# Altium project imu_board.PrjPcb
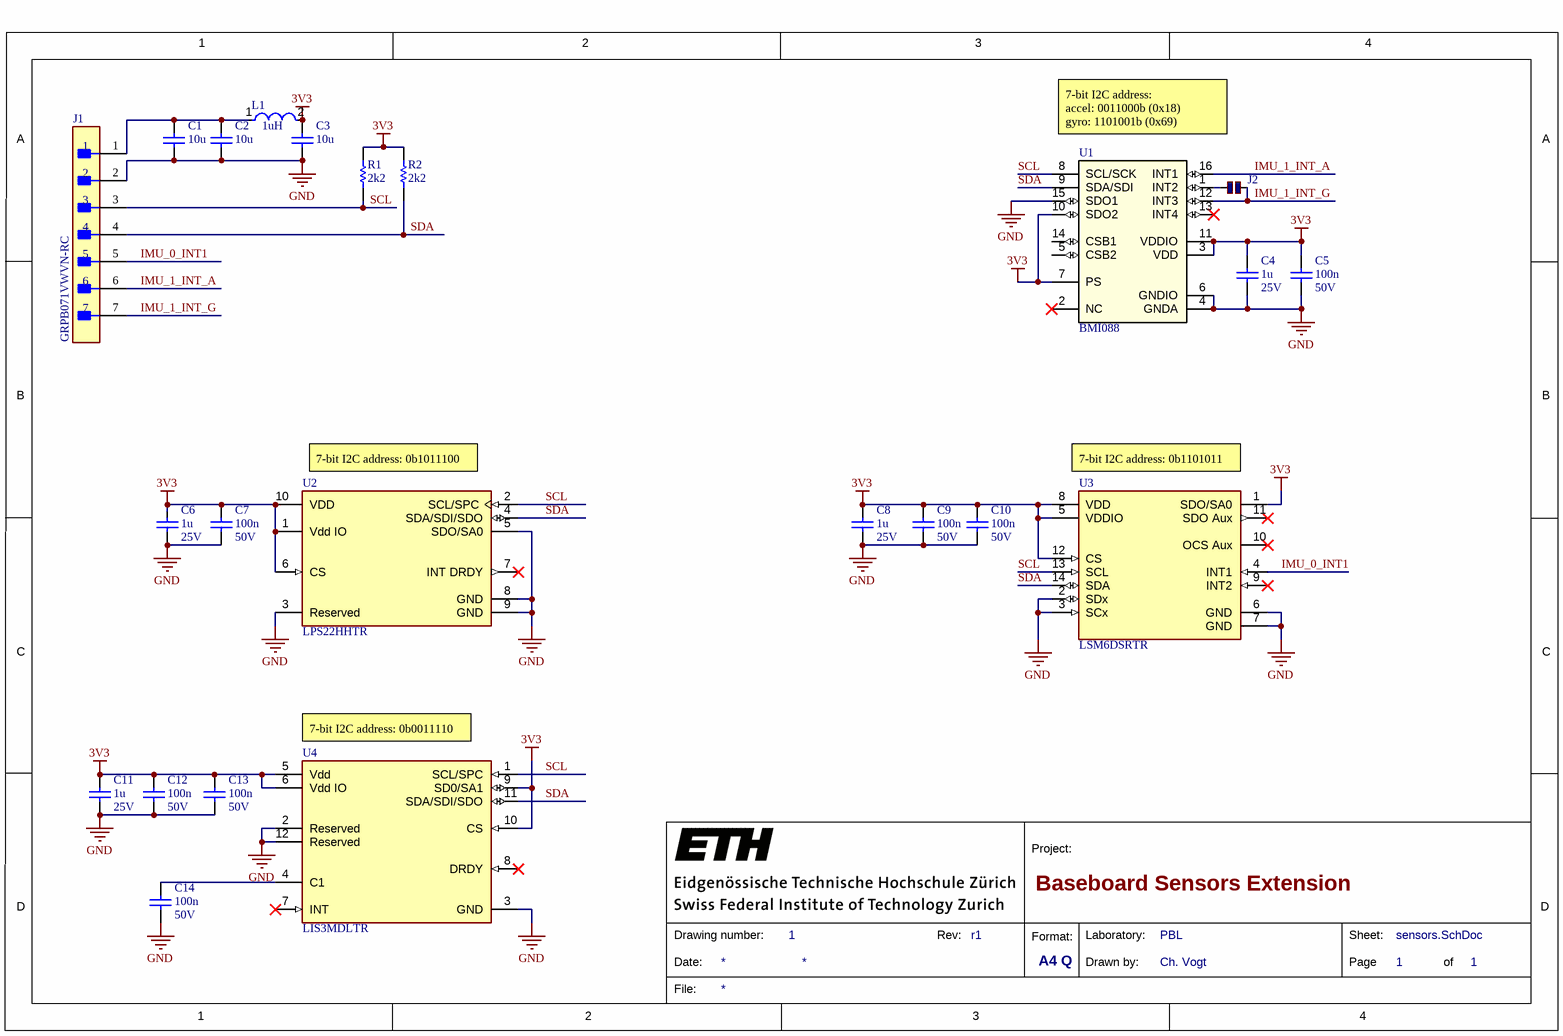
[diagram p0: sensors.SchDoc]
1 sheet, 23 parts. Net scope: global (net labels, ports and power ports of the same name join across sheets).
Board file: imu_board_r1.PcbDoc

## Sheet sensors.SchDoc: Baseboard Sensors Extension
size A4; DrawnBy: Ch. Vogt; Organization: PBL; DocumentNumber: 1; Revision: r1; SheetNumber: 1; SheetTotal: 1

### Parts
C1  10u  [CAPC0402]
C2  10u  [CAPC0402]
C3  10u  [CAPC0402]
C4  1u  Rated DC Voltage (URdc): 25V  [CAPC0402]
C5  100n  Rated DC Voltage (URdc): 50V  [CAPC0402]
C6  1u  Rated DC Voltage (URdc): 25V  [CAPC0402]
C7  100n  Rated DC Voltage (URdc): 50V  [CAPC0402]
C8  1u  Rated DC Voltage (URdc): 25V  [CAPC0402]
C9  100n  Rated DC Voltage (URdc): 50V  [CAPC0402]
C10  100n  Rated DC Voltage (URdc): 50V  [CAPC0402]
C11  1u  Rated DC Voltage (URdc): 25V  [CAPC0402]
C12  100n  Rated DC Voltage (URdc): 50V  [CAPC0402]
C13  100n  Rated DC Voltage (URdc): 50V  [CAPC0402]
C14  100n  Rated DC Voltage (URdc): 50V  [CAPC0402]
J1  GRPB071VWVN-RC  [FP-GRPB071VWVN-RC-MFG]
J2  Solder Jumper  [Small Solder Jumper]  (value not drawn)
L1  Inductance: 1uH  [FP-MLZ1005-MFG]  (hidden comment: MLZ1005M1R0WT000)
R1  2k2  [RES0402]
R2  2k2  [RES0402]
U1  BMI088  [QFN_BMI085_BOS]
U2  LPS22HHTR  [FP-HLGA-10L-DM00386636-MFG]
U3  LSM6DSRTR  [FP-LGA-14L-DM00249496-MFG]
U4  LIS3MDLTR  [FP-VFLGA-12-8365767-MFG]

### Nets
3V3: C3.2 C4.2 C5.2 C6.2 C7.2 C8.2 C9.2 C10.2 C11.2 C12.2 C13.2 L1.2 R1.2 R2.2 U1.3(VDD) U1.7(PS) U1.10(SDO2) U1.11(VDDIO) U2.1(Vdd_IO) U2.6(CS) U2.10(VDD) U3.1(SDO/SA0) U3.5(VDDIO) U3.8(VDD) U3.12(CS) U4.5(Vdd) U4.6(Vdd_IO) U4.9(SD0/SA1) U4.10(CS)
GND: C1.1 C2.1 C3.1 C4.1 C5.1 C6.1 C7.1 C8.1 C9.1 C10.1 C11.1 C12.1 C13.1 C14.1 J1.2 U1.4(GNDA) U1.6(GNDIO) U1.15(SDO1) U2.3(Reserved) U2.5(SDO/SA0) U2.8(GND) U2.9(GND) U3.2(SDx) U3.3(SCx) U3.6(GND) U3.7(GND) U4.2(Reserved) U4.3(GND) U4.12(Reserved)
IMU_0_INT1: J1.5 U3.4(INT1)
IMU_1_INT_A: J1.6 U1.16(INT1)
IMU_1_INT_G: J1.7 J2.1 U1.12(INT3)
SCL: J1.3 R1.1 U1.8(SCL/SCK) U2.2(SCL/SPC) U3.13(SCL) U4.1(SCL/SPC)
SDA: J1.4 R2.1 U1.9(SDA/SDI) U2.4(SDA/SDI/SDO) U3.14(SDA) U4.11(SDA/SDI/SDO)
NetC1_2: C1.2 C2.2 J1.1 L1.1
NetC14_2: C14.2 U4.4(C1)
NetJ2_2: J2.2 U1.1(INT2)

Not connected (* = marked no-connect by the designer): U1 2(NC)* 5(CSB2) 13(INT4)* 14(CSB1); U2 7(INT_DRDY)*; U3 9(INT2)* 10(OCS_Aux)* 11(SDO_Aux)*; U4 7(INT)* 8(DRDY)*

### Notes on the sheet
- 7-bit I2C address:
  accel: 0011000b (0x18)
  gyro: 1101001b (0x69)
- (near U2) 7-bit I2C address: 0b1011100
- (near U3) 7-bit I2C address: 0b1101011
- (near U4) 7-bit I2C address: 0b0011110
- 1
- 2
- 3
- 4
- A
- B
- C
- Project:
- D
- Date:
- Drawing number:
- Rev:
- Format:
- A4 Q
- Drawn by:
- Laboratory:
- Page
- Sheet:
- of
- File:

### Library data of the parts
C1-C3 = cap0402: Ceramic Capacitor, Multilayer, Ceramic, 10V, 20% +Tol, 20% -Tol, X5R, 15% TC, 10uF, Surface Mount, 0402; Manufacturer: Samsung; Manufacturer Part Number: CL05A106MP5NUNC; Multilayer: Yes; Supplier: Digikey; Supplier Part Number: 1276-1450-1-ND; RoHS: Yes; Category: Ceramic Capacitors; Stock: 2505826; Pricing: 1=0.18, 10=0.115, 50=0.0726, 100=0.058, 500=0.04192, 1000=0.03708, 2500=0.03546, 5000=0.03224 (USD); Mounting Technology: Surface Mount; Pins: 2; Dielectric Material: Ceramic; Package Shape: Rectangular; Case/Package: 0402; Terminal Finish: Nickel; Min Operating Temperature: -55°C; Max Operating Temperature: 85°C; Value: 10uF; Capacitor Type: Ceramic; Tolerance  (fill in as +-): 20%; Packaging: Tape and Reel; Tolerance (fill in as +-): 20%; Rated DC Voltage (URdc): 10V; Termination: Wraparound; Temperature Characteristics Code: X5R; JESD-609 Code: e3; Package Style: SMTMeter; Length: 1mm; Width: 0.5mm; Height: 0.7mm; RoHS Compliant: Yes; Reach SVHC Compliant: Yes; ComponentLink1URL: https://datasheet.ciiva.com:443/pdfs/VipMasterIC/IC/SEMS/SEMS-S-A0008384515/SEMS-S-A0008872829-1.pdf?src-supplier=IHS+Markit; ComponentLink1Description: https://datasheet.ciiva.com:443/pdfs/VipMasterIC/IC/SEMS/SEMS-S-A0008384515/SEMS-S-A0008872829-1.pdf?src-supplier=IHS+Markit
C4 C6 C8 C11 = cap0402: Ceramic Capacitor, Multilayer, Ceramic, 25V, 20% +Tol, 20% -Tol, X5R, 15% TC, 1uF, Surface Mount, 0402; Manufacturer: Taiyo Yuden; Manufacturer Part Number: TMK105BJ105MV-F; Multilayer: Yes; Supplier: Rs; Supplier Part Number: 1843748; RoHS: Yes; Category: Ceramic Capacitors; Stock: 2400; Pricing: 200=0.05600, 600=0.05000, 1000=0.03900 (CHF); Mounting Technology: Surface Mount; Pins: 2; Dielectric Material: Ceramic; Case/Package: 0402; Package Shape: Rectangular; Terminal Finish: Nickel; Min Operating Temperature: -55°C; Max Operating Temperature: 85°C; Value: 1uF; Capacitor Type: Ceramic; Tolerance  (fill in as +-): 20%; Packaging: Tape and Reel; Tolerance (fill in as +-): 20%; Temperature Characteristics Code: X5R; Termination: Wraparound; Package Style: SMTMeter; JESD-609 Code: e3; Length: 1mm; Width: 0.5mm; Height: 0.5mm; Reach SVHC Compliant: Yes; RoHS Compliant: Yes; ComponentLink1URL: https://datasheet.ciiva.com:443/pdfs/VipMasterIC/IC/TAIY/TAIY-S-A0009103435/TAIY-S-A0009102669-1.pdf?src-supplier=IHS+Markit; ComponentLink1Description: https://datasheet.ciiva.com:443/pdfs/VipMasterIC/IC/TAIY/TAIY-S-A0009103435/TAIY-S-A0009102669-1.pdf?src-supplier=IHS+Markit; ComponentLink2URL: https://datasheet.ciiva.com/11596/tmk105bj105mv-f-ss-11596466.pdf?src-supplier=Avnet; ComponentLink2Description: https://datasheet.ciiva.com/11596/tmk105bj105mv-f-ss-11596466.pdf?src-supplier=Avnet; ComponentLink3URL: https://datasheet.ciiva.com/30154/128tmk105bj105mv-f-30154639.pdf?src-supplier=Onlinecomponents.com; ComponentLink3Description: https://datasheet.ciiva.com/30154/128tmk105bj105mv-f-30154639.pdf?src-supplier=Onlinecomponents.com; ComponentLink4URL: https://datasheet.ciiva.com/15922/tmk105bj105mv-f-pdf-15922317.pdf?src-supplier=Onlinecomponents.com; ComponentLink4Description: https://datasheet.ciiva.com/15922/tmk105bj105mv-f-pdf-15922317.pdf?src-supplier=Onlinecomponents.com; ComponentLink5URL: https://datasheet.ciiva.com/13404/mlcc-all-e-541559-13404206.pdf?src-supplier=Mouser; ComponentLink5Description: https://datasheet.ciiva.com/13404/mlcc-all-e-541559-13404206.pdf?src-supplier=Mouser
C5 C7 C9 C10 C12-C14 = cap0402: Ceramic Capacitor, Multilayer, Ceramic, 50V, 10% +Tol, 10% -Tol, X5R, 15% TC, 0.1uF, Surface Mount, 0402; Manufacturer: Yageo; Manufacturer Part Number: CC0402KRX5R9BB104; Capacitance: 100nF; Multilayer: Yes; Supplier 1: Farnell; Supplier Part Number 1: 3366442; RoHS: Yes; Category: Ceramic Capacitors; Stock 1: 180000; Pricing 1: 10000=0.00890, 50000=0.00870 (CHF); Mount: Surface Mount; Number of Pins: 2; Dielectric Material: Ceramic; Package Shape: Rectangular; Size Code: 0402; Terminal Finish: Nickel; Min Operating Temperature: -55°C; Max Operating Temperature: 85°C; JESD-609 Code: e3; Capacitor Type: Ceramic; Negative Tolerance: 10%; Temperature Characteristics Code: X5R; Termination: Wraparound; Positive Tolerance: 10%; Package Style: SMTMeter; Packaging: Tape and Reel; Length: 1mm; Width: 0.5mm; Height: 0.5mm; Reach SVHC Compliant: Yes; RoHS Compliant: Yes; ComponentLink1URL: https://datasheet.ciiva.com:443/pdfs/VipMasterIC/IC/YAGO/YAGO-S-A0006851646/YAGO-S-A0006851646-1.pdf?src-supplier=IHS+Markit; ComponentLink1Description: https://datasheet.ciiva.com:443/pdfs/VipMasterIC/IC/YAGO/YAGO-S-A0006851646/YAGO-S-A0006851646-1.pdf?src-supplier=IHS+Markit; ComponentLink2URL: http://www.yageo.com/documents/recent/UPY-GPHC_X5R_4V-to-50V_25.pdf?src-supplier=Digi-Key; ComponentLink2Description: http://www.yageo.com/documents/recent/UPY-GPHC_X5R_4V-to-50V_25.pdf?src-supplier=Digi-Key; ComponentLink3URL: http://www.yageo.com/documents/recent/UPY-GPHC_X5R_4V-to-50V_23.pdf?src-supplier=Digi-Key; ComponentLink3Description: http://www.yageo.com/documents/recent/UPY-GPHC_X5R_4V-to-50V_23.pdf?src-supplier=Digi-Key
J1 = CMP-25680-000036-1: CONN HEADER VERT 7POS 1.27MM; Pitch: 0.05inch; Connector Type: Male Pin; Number of Positions: 7; Contact Mating Length: 0.118inch; Number of Rows: 1; Mount: Through Hole; Packaging: Bulk; Contact Type: Male Pin; Contact Plating: Gold; Termination: Solder; Lead Free: Lead Free; Package Quantity: 1; RoHS Compliant: Yes
J2 = CMP-00005-5: Value: 1; Technology: SMT
L1 = CMP-08253-000219-1: Shielded Multilayer Inductor 1uH ±20% 450mA 455mΩ SMD 0402; Core Material: Ferrite; Saturation Current: 100mA; Self Resonant Frequency: 170MHz; DC Resistance (DCR): 455mR; Test Frequency: 2MHz; Width: 0.02inch; Tolerance: 20%; Package Quantity: 10000; Current Rating: 450mA; Length: 0.039inch; RoHS Compliant: Yes; Max Operating Temperature: 125°C; Height - Seated (Max): 0.022inch; Packaging: Tape and Reel; Case Code (Metric): 1005; Case Code (Imperial): 0402; Min Operating Temperature: -55°C; Case/Package: 0402; Mount: Surface Mount; Shielding: Shielded
R1 R2 = res0402: Fixed Resistor, Metal Glaze/thick Film, 0.063W, 2200ohm, 50V, 1% +/-Tol, 100ppm/Cel, Surface Mount, 0402; Manufacturer: Vishay; Manufacturer Part Number: CRCW04022K20FKED; Power: 63mW; Value: 2.2kR; Temperature Coefficient: 100ppm/°C; Rated Temperature: 70°C; Package Height: 0.35mm; Package Length: 1mm; Package Width: 0.5mm; Reference Standard: AEC-Q200; Supplier: Farnell; Supplier Part Number: 2121643; RoHS: Yes; Category: Chip SMD Resistors; Stock: 30000; Pricing: 10000=0.00400, 50000=0.00390, 100000=0.00380 (CHF); Mounting Technology: Surface Mount; Pins: 2; Case/Package: 0402; Package Shape: Rectangular; Terminal Finish: Nickel; Min Operating Temperature: -55°C; Max Operating Temperature: 155°C; Tolerance: 1%; Resistor Type: FIXED RESISTOR; Termination: Wraparound; Packaging: Tape and Reel; Technology: METAL GLAZE/THICK FILM; Working Voltage: 50V; Package Style: SMTMeter; Construction: Chip; JESD-609 Code: e3; RoHS Compliant: Yes; Reach SVHC Compliant: Yes; ComponentLink1URL: https://datasheet.ciiva.com:443/pdfs/VipMasterIC/IC/VISH/VISH-S-A0007266705/VISH-S-A0007266705-1.pdf?src-supplier=IHS+Markit; ComponentLink1Description: https://datasheet.ciiva.com:443/pdfs/VipMasterIC/IC/VISH/VISH-S-A0007266705/VISH-S-A0007266705-1.pdf?src-supplier=IHS+Markit; ComponentLink2URL: https://datasheet.ciiva.com/11811/0900766b80d98824-11811709.pdf?src-supplier=Rs; ComponentLink2Description: https://datasheet.ciiva.com/11811/0900766b80d98824-11811709.pdf?src-supplier=Rs; ComponentLink3URL: https://datasheet.ciiva.com/3256/dcrcwe3-3256341.pdf?src-supplier=Avnet; ComponentLink3Description: https://datasheet.ciiva.com/3256/dcrcwe3-3256341.pdf?src-supplier=Avnet; ComponentLink4URL: https://datasheet.ciiva.com/16209/dcrcwe3-16209157.pdf?src-supplier=Future+Electronics; ComponentLink4Description: https://datasheet.ciiva.com/16209/dcrcwe3-16209157.pdf?src-supplier=Future+Electronics; ComponentLink5URL: https://datasheet.ciiva.com/2464/dcrcwe3-2464486.pdf?src-supplier=Digi-Key; ComponentLink5Description: https://datasheet.ciiva.com/2464/dcrcwe3-2464486.pdf?src-supplier=Digi-Key; ComponentLink6URL: https://datasheet.ciiva.com/2464/dcrcwe3-2464487.pdf?src-supplier=Digi-Key; ComponentLink6Description: https://datasheet.ciiva.com/2464/dcrcwe3-2464487.pdf?src-supplier=Digi-Key; ComponentLink7URL: https://datasheet.ciiva.com/2464/dcrcwe3-2464488.pdf?src-supplier=Digi-Key; ComponentLink7Description: https://datasheet.ciiva.com/2464/dcrcwe3-2464488.pdf?src-supplier=Digi-Key; ComponentLink8URL: https://datasheet.ciiva.com/5541/dcrcwe3-109170-5541416.pdf?src-supplier=Mouser; ComponentLink8Description: https://datasheet.ciiva.com/5541/dcrcwe3-109170-5541416.pdf?src-supplier=Mouser; ComponentLink9URL: https://datasheet.ciiva.com/26316/fld-crcw-e3-data-en-26316650.pdf?src-supplier=Distrelec; ComponentLink9Description: https://datasheet.ciiva.com/26316/fld-crcw-e3-data-en-26316650.pdf?src-supplier=Distrelec; ComponentLink10URL: https://datasheet.ciiva.com/7777/1697337-7777227.pdf?src-supplier=Element14; ComponentLink10Description: https://datasheet.ciiva.com/7777/1697337-7777227.pdf?src-supplier=Element14; ComponentLink11URL: https://datasheet.ciiva.com/7777/1697337-7777228.pdf?src-supplier=Element14; ComponentLink11Description: https://datasheet.ciiva.com/7777/1697337-7777228.pdf?src-supplier=Element14; ComponentLink12URL: https://datasheet.ciiva.com/16778/70201119-16778943.pdf?src-supplier=Allied+Electronics; ComponentLink12Description: https://datasheet.ciiva.com/16778/70201119-16778943.pdf?src-supplier=Allied+Electronics
U1 = BMI088: No Description Available; Mfr_Name: Bosch Sensortec; Copyright: Copyright (C) 2024 Ultra Librarian. All rights reserved.; Manufacturer_Part_Number: BMI088; RefDes: RefDes; Type: DEV
U2 = CMP-12182-000001-1: CONSUMER MEMS; Manufacturer: STMicroelectronics; Operating Supply Current: 4-12uA; Sensor Output: I2C,SPI; Port Style: No Port; Min Supply Voltage: 1.7V; Max Supply Voltage: 3.7V; Package: HLGA-10L-DM00386636; Temperature Range Low: -40°C; RoHS: TRUE; Device Class L1: Sensors; Automotive: No; Manufacturer Part Number: LPS22HHTR; ComponentLink2URL: https://www.st.com/resource/en/datasheet/lps22hh.pdf; Temperature: -40°C to +85°C; Category: IC; Device Class L3: unset; ComponentLink2Description: Datasheet; Lead Free: Yes; Temperature Range High: +85°C; Octopart: https://octopart.com/lps22hhtr-stmicroelectronics-94834025; Footprint Url: https://www.st.com/content/ccc/resource/technical/document/technical_note/73/17/9c/16/dd/96/4a/01/CD00134799.pdf/files/CD00134799.pdf/jcr:content/translations/en.CD00134799.pdf; Height: 0.8mm; Device Class L2: Pressure Sensors; Digikey Description: CONSUMER MEMS
U3 = CMP-12177-000003-1: INEMO INERTIAL MODULE: 3D ACCELE; Manufacturer: STMicroelectronics; Sensor Output: I2C,SPI; Accel Range: 2/4/8/16g; Gyro Range: 125/250/500/1000/2000/4000°/s; Operating Supply Current: 360-1200uA; Max Supply Voltage: 3.6V; Min Supply Voltage: 1.62V; Sensor Type: Temperature,Accelerometer,Gyroscope; Device Class L3: Inertial Measurement Units (IMUs); Package: LGA-14L-DM00249496; ComponentLink2Description: Datasheet; Mouser Description: In a Pack of 2, LSM6DSRTR STMicroelectronics, 3-Axis Accelerometer, Gyroscope, 14-Pin LGA; Footprint Url: https://www.st.com/content/ccc/resource/technical/document/technical_note/73/17/9c/16/dd/96/4a/01/CD00134799.pdf/files/CD00134799.pdf/jcr:content/translations/en.CD00134799.pdf; RoHS: TRUE; Automotive: No; Temperature Range High: +85°C; Digikey Description: INEMO INERTIAL MODULE: 3D ACCELE; Manufacturer Part Number: LSM6DSRTR; ComponentLink2URL: https://www.st.com/resource/en/datasheet/lsm6dsr.pdf; Lead Free: Yes; Category: IC; Temperature Range Low: -40°C; Height: 0.86mm; Octopart: https://octopart.com/lsm6dsrtr-stmicroelectronics-93180177; Temperature: -40°C to +85°C; Device Class L1: Sensors; Device Class L2: Motion Sensors
U4 = CMP-2000-07463-2: SENSOR MR I2C/SPI 12LGA; Manufacturer: STMicroelectronics; Sensor Output: I2C,SPI; Operating Supply Current: 40-270uA; Max Supply Voltage: 3.6V; Sensing Method: Magnetic; Min Supply Voltage: 1.71V; ComponentLink2URL: https://www.st.com/resource/en/datasheet/lis3mdl.pdf; Category: IC; Manufacturer Part Number: LIS3MDLTR; Octopart: https://octopart.com/lis3mdltr-stmicroelectronics-29403125; Automotive: No; ComponentLink2Description: Datasheet; RoHS: TRUE; Device Class L3: unset; Device Class L1: Sensors; Temperature: -40°C to +85°C; Height: 1mm; Mouser Description: Board Mount Hall Effect / Magnetic Sensors Ultra Lo-Pwr Hi Perf 3-Axis 1.9-3.6V; Temperature Range High: +85°C; Lead Free: Yes; Device Class L2: Magnetic Sensors; Footprint Url: https://www.st.com/content/ccc/resource/technical/document/technical_note/73/17/9c/16/dd/96/4a/01/CD00134799.pdf/files/CD00134799.pdf/jcr:content/translations/en.CD00134799.pdf; Temperature Range Low: -40°C; Package: VFLGA-12-8365767; Digikey Description: SENSOR MR I2C/SPI 12LGA